# Altium schematic sheet Analog.SchDoc
size A
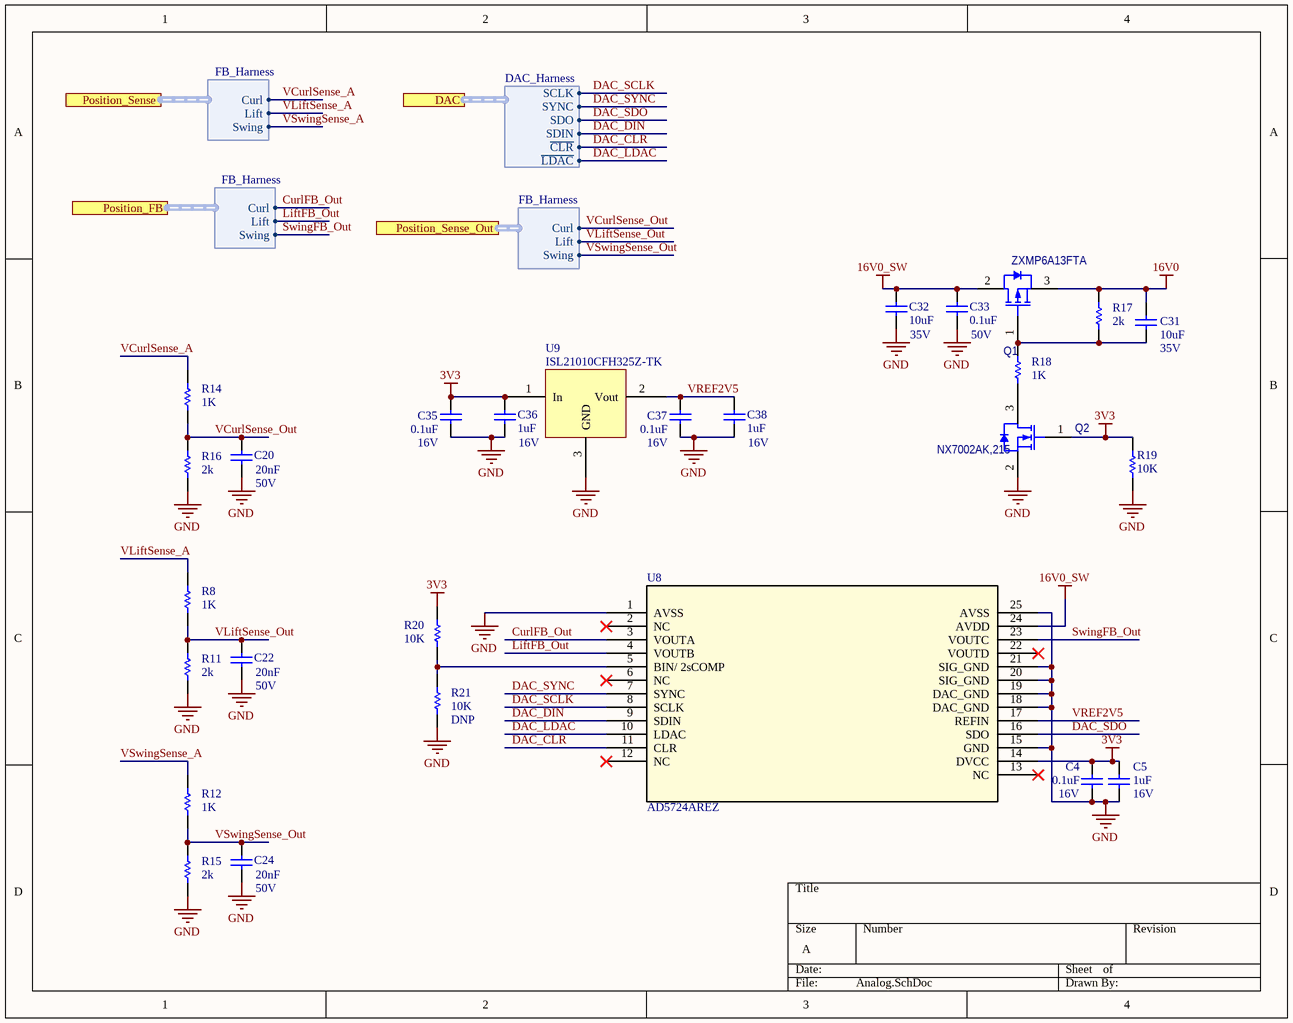
[diagram p0: Analog.SchDoc]

## Parts
C4  0.1uF  Voltage - Rated: 16V  [CAPC1005(0402)N]
C5  1uF  Voltage - Rated: 16V  [CAPC1005(0402)N]
C20  value 20nF  Voltage - Rated: 50V  [0402]  (hidden comment: Cap)
C22  value 20nF  Voltage - Rated: 50V  [0402]  (hidden comment: Cap)
C24  value 20nF  Voltage - Rated: 50V  [0402]  (hidden comment: Cap)
C31  10uF  Voltage - Rated: 35V  [CAPC2012X145N]
C32  10uF  Voltage - Rated: 35V  [CAPC2012X145N]
C33  0.1uF  Voltage - Rated: 50V  [CAPC1005(0402)N]
C35  0.1uF  Voltage - Rated: 16V  [CAPC1005(0402)N]
C36  1uF  Voltage - Rated: 16V  [CAPC1005(0402)N]
C37  0.1uF  Voltage - Rated: 16V  [CAPC1005(0402)N]
C38  1uF  Voltage - Rated: 16V  [CAPC1005(0402)N]
Q1  ZXMP6A13FTA  [*SOT95P230X110-3P]
Q2  NX7002AK,215  [*SOT95P230X110-3N]
R8  value 1K  [0402]  (hidden comment: Res1)
R11  value 2k  [0402]  (hidden comment: Res1)
R12  value 1K  [0402]  (hidden comment: Res1)
R14  value 1K  [0402]  (hidden comment: Res1)
R15  value 2k  [0402]  (hidden comment: Res1)
R16  value 2k  [0402]  (hidden comment: Res1)
R17  value 2k  [0402]  (hidden comment: Res1)
R18  value 1K  [0402]  (hidden comment: Res1)
R19  10K  [RESC1005(0402)N]
R20  value 10K  [0402]  (hidden comment: Res1)
R21  value 10K  [0402]  (hidden comment: Res1)
U8  AD5724AREZ  [RE_24]
U9  ISL21010CFH325Z-TK  [SOT95P237X111-3N]

## Ports
DAC (harness DAC_Harness), Position_FB (harness FB_Harness), Position_Sense (harness FB_Harness), Position_Sense_Out (harness FB_Harness)

## Harnesses
FB_Harness: Lift, Curl, Swing
DAC_Harness: SDIN, SDO, SCLK, SYNC, ~{CLR}, ~{LDAC}

## Nets
3V3: C4.2 C5.2 C35.2 C36.2 Q2.1(G1) R19.2 R20.2 U8.14(DVCC) U9.1(In)
16V0: C31.2 Q1.3(S1) R17.2
16V0_SW: C32.1 C33.2 Q1.2(D1) U8.24(AVDD)
GND: C4.1 C5.1 C20.1 C22.1 C24.1 C32.2 C33.1 C35.1 C36.1 C37.1 C38.1 Q2.2(S1) R11.1 R15.1 R16.1 R19.1 R21.1 U8.1(AVSS) U8.15(GND) U8.18(DAC_GND) U8.19(DAC_GND) U8.20(SIG_GND) U8.21(SIG_GND) U8.25(AVSS) U9.3(GND)
CurlFB_Out: U8.3(VOUTA) ; port Position_FB.Curl
DAC_~{CLR}: U8.11(CLR) ; port DAC.~{CLR}
DAC_DIN: U8.9(SDIN) ; port DAC.SDIN
DAC_~{LDAC}: U8.10(LDAC) ; port DAC.~{LDAC}
DAC_SCLK: U8.8(SCLK) ; port DAC.SCLK
DAC_SDO: U8.16(SDO) ; port DAC.SDO
DAC_SYNC: U8.7(SYNC) ; port DAC.SYNC
LiftFB_Out: U8.4(VOUTB) ; port Position_FB.Lift
SwingFB_Out: U8.23(VOUTC) ; port Position_FB.Swing
VCurlSense_A: R14.2 ; port Position_Sense.Curl
VCurlSense_Out: C20.2 R14.1 R16.2 ; port Position_Sense_Out.Curl
VLiftSense_A: R8.2 ; port Position_Sense.Lift
VLiftSense_Out: C22.2 R8.1 R11.2 ; port Position_Sense_Out.Lift
VREF2V5: C37.2 C38.2 U8.17(REFIN) U9.2(Vout)
VSwingSense_A: R12.2 ; port Position_Sense.Swing
VSwingSense_Out: C24.2 R12.1 R15.2 ; port Position_Sense_Out.Swing
NetC31_1: C31.1 Q1.1(G1) R17.1 R18.2
NetQ2_3: Q2.3(D1) R18.1
NetR20_1: R20.1 R21.2 U8.5(BIN/_2sCOMP)

Not connected (* = marked no-connect by the designer): U8 2(NC)* 6(NC)* 12(NC)* 13(NC)* 22(VOUTD)*

## Library data of the parts
C4 C35 C37 = CAP: CAP CER 0.1UF 16V X5R 0402; Manufacturer 1: Murata; Manufacturer Part Number 1: GRM155R61C104KA88D; Tolerance: ±10%; Level: 1; Vendor PN: 490-5415-1-ND; Temperature Coefficient: X5R; RoHS: RoHS Compliant; Category: Capacitors; Capacitance: 0.1uF; Mounting Type: Surface Mount, MLCC; Operating Temperature: -55°C ~ 85°C; Package / Case: 0402 (1005 Metric); Size / Dimension: 0.039" L x 0.020" W (1.00mm x 0.50mm); Thickness (Max): 0.022" (0.55mm)
C5 C36 C38 = CAP: Manufacturer 1: Samsung; Manufacturer Part Number 1: CL05A105KO5NNNC; Temperature Coefficient: X5R; Tolerance: ±10%; Level: 1; Vendor PN: 1276-1067-1-ND; RoHS: RoHS Compliant; Category: Capacitors; Capacitance: 1uF; Mounting Type: Surface Mount, MLCC; Operating Temperature: -55°C ~ 85°C; Package / Case: 0402 (1005 Metric); Size / Dimension: 0.039" L x 0.020" W (1.00mm x 0.50mm); Thickness (Max): 0.022" (0.55mm)
C20 C22 C24 = Cap: Capacitor; Vendor PN: 478-10122-1-ND; Published: 8-Jun-2000; LatestRevisionDate: 17-Jul-2002; LatestRevisionNote: Re-released for DXP Platform.; PackageReference: RAD-0.3; Publisher: Altium Limited; PackageDescription: Radial Cap, Thru-Hole; 2 Leads; 0.3 in Pin Spacing
C31 C32 = CAP: Manufacturer 1: Samsung; Manufacturer Part Number 1: GRM21BC8YA106ME11L; Tolerance: ±10%; Level: 1; Vendor PN: 490-10505-1-ND; RoHS: RoHS Compliant; Category: Capacitors; Capacitance: 10uF; Mounting Type: Surface Mount, MLCC; Operating Temperature: -55°C ~ 85°C; Package / Case: 0805 (2012 Metric); Size / Dimension: 0.039" L x 0.020" W (1.00mm x 0.50mm); Thickness (Max): 0.022" (0.55mm)
C33 = CAP: CAP CER 0.1UF 16V X5R 0402; Manufacturer 1: Murata; Manufacturer Part Number 1: GRM155R71H104KE14J; Tolerance: ±10%; Level: 1; Vendor PN: 490-13342-1-ND; Temperature Coefficient: X5R; RoHS: RoHS Compliant; Category: Capacitors; Capacitance: 0.1uF; Mounting Type: Surface Mount, MLCC; Operating Temperature: -55°C ~ 85°C; Package / Case: 0402 (1005 Metric); Size / Dimension: 0.039" L x 0.020" W (1.00mm x 0.50mm); Thickness (Max): 0.022" (0.55mm)
Q1 = RZM001P02T2L: MOSFET P-CH 20V 0.1A VMT3; Manufacturer 1: Diodes Inc; Vendor PN: ZXMP6A13FCT-ND; ComponentLink1Description: Datasheet; ComponentLink1URL: https://www.rohm.com/datasheet/RZM001P02/rzm001p02t2l-e; Category: MOSFETs; Manufacturer Part Number 1: ZXMP6A13FTA
Q2 = NX7002AKVL: MOSFET 60 V, Single N-chan Trench; Manufacturer 1: Nexperia; Vendor PN: 1727-1289-1-ND; Manufacturer Part Number 1: NX7002AK,215; ComponentLink1Description: Datasheet; ComponentLink1URL: https://assets.nexperia.com/documents/data-sheet/NX7002AK.pdf; Category: MOSFETs
R8 R12 R14 R18 = Res1: Resistor; Vendor PN: 311-1.00KLRCT-ND; Published: 8-Jun-2000; LatestRevisionDate: 17-Jul-2002; LatestRevisionNote: Re-released for DXP Platform.; PackageReference: AXIAL-0.3; Publisher: Altium Limited; PackageDescription: Axial Device, Thru-Hole; 2 Leads; 0.3 in Pin Spacing; DNP: *
R11 R15-R17 = Res1: Resistor; Vendor PN: 311-2KLRCT-ND; Published: 8-Jun-2000; LatestRevisionDate: 17-Jul-2002; LatestRevisionNote: Re-released for DXP Platform.; PackageReference: AXIAL-0.3; Publisher: Altium Limited; PackageDescription: Axial Device, Thru-Hole; 2 Leads; 0.3 in Pin Spacing; DNP: *
R19 = RES: Resistor, Chip; Manufacturer 1: Stackpole; Manufacturer Part Number 1: RMCF0402FT10K0; Level: 1; Vendor PN: RMCF0402FT10K0CT-ND; Category: Resistors; Number of Terminations: 2; Composition: -; Power (Watts): -; Resistance: 10K; Temperature Coefficient: -; Tolerance: -; Package / Case: 0402 (1005 Metric)
R20 = Res1: Resistor; Vendor PN: RMCF0402FT10K0CT-ND; Published: 8-Jun-2000; LatestRevisionDate: 17-Jul-2002; LatestRevisionNote: Re-released for DXP Platform.; PackageReference: AXIAL-0.3; Publisher: Altium Limited; PackageDescription: Axial Device, Thru-Hole; 2 Leads; 0.3 in Pin Spacing; DNP: *
R21 = Res1: Resistor; Vendor PN: 311-10.0KLRCT-ND; Published: 8-Jun-2000; LatestRevisionDate: 17-Jul-2002; LatestRevisionNote: Re-released for DXP Platform.; PackageReference: AXIAL-0.3; Publisher: Altium Limited; PackageDescription: Axial Device, Thru-Hole; 2 Leads; 0.3 in Pin Spacing; DNP: DNP
U8 = AD5724AREZ: No Description Available; Vendor: Analog Devices Inc; Built_By: EMA_UL_Team; Vendor PN: AD5724AREZ-REEL7CT-ND; Manufacturer_Part_Number: AD5724AREZ; Copyright: Copyright (C) 2018 Accelerated Designs. All rights reserved; RefDes: RefDes; Type: DEV; Value: Value
U9 = ISL21010CFH325Z-TK: Vendor PN: ISL21010CFH325Z-TKCT-ND